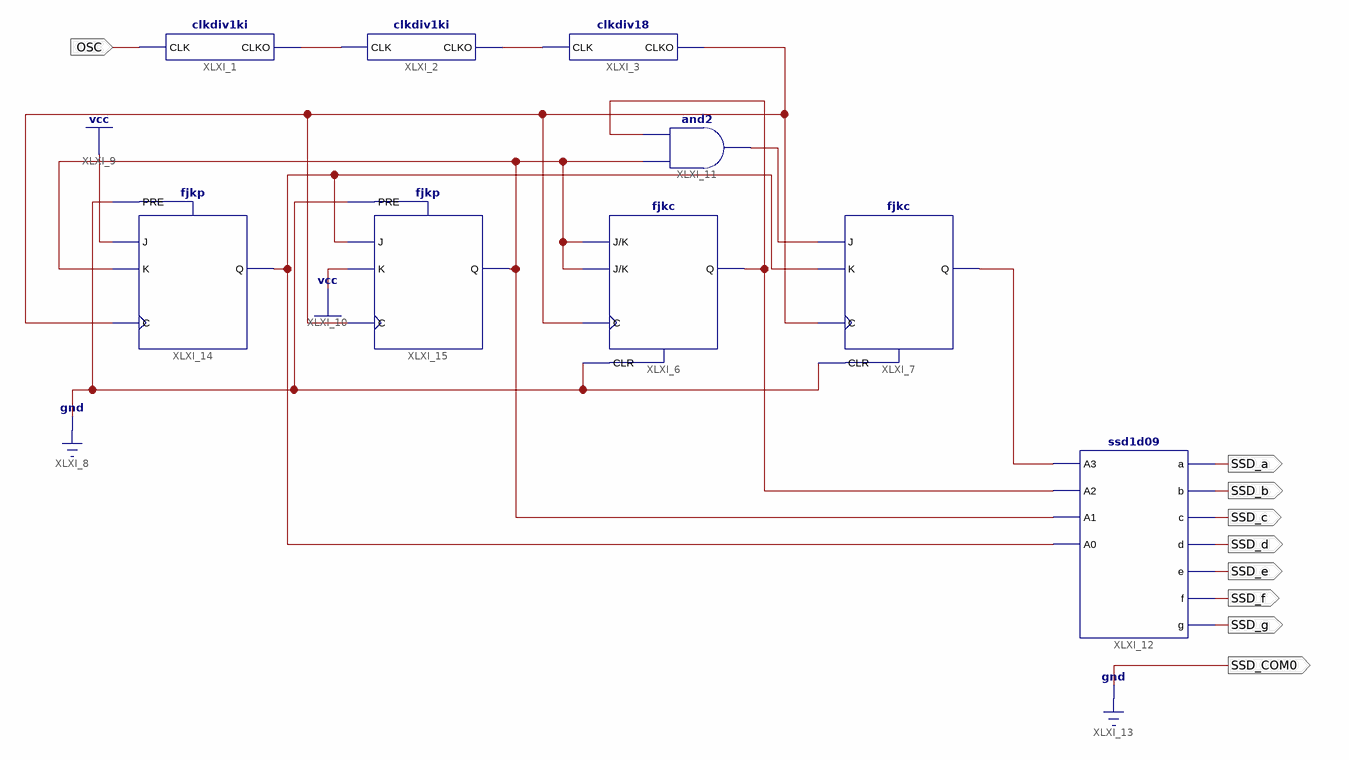
[diagram p0: schematic sheet 1]
// Xilinx ISE schematic integration.sch (spartan6) as structural Verilog: 9 symbols, 9 ports
module integration (
  input  OSC,
  output SSD_a,
  output SSD_b,
  output SSD_c,
  output SSD_d,
  output SSD_e,
  output SSD_f,
  output SSD_g,
  output SSD_COM0
);

  wire XLXN_2, XLXN_3, XLXN_8, XLXN_17, XLXN_18, XLXN_20, XLXN_21, XLXN_22;

  clkdiv1ki XLXI_1 (.CLK(OSC), .CLKO(XLXN_2));
  clkdiv1ki XLXI_2 (.CLK(XLXN_2), .CLKO(XLXN_3));
  clkdiv18 XLXI_3 (.CLK(XLXN_3), .CLKO(XLXN_8));
  fjkc XLXI_6 (.C(XLXN_8), .CLR(1'b0), .J(XLXN_18), .K(XLXN_18), .Q(XLXN_21));
  fjkc XLXI_7 (.C(XLXN_8), .CLR(1'b0), .J(XLXN_20), .K(XLXN_17), .Q(XLXN_22));
  and XLXI_11 (XLXN_20, XLXN_18, XLXN_21);
  ssd1d09 XLXI_12 (
    .a(SSD_a), .A0(XLXN_17), .A1(XLXN_18), .A2(XLXN_21), .A3(XLXN_22), .b(SSD_b), .c(SSD_c), .d(SSD_d),
    .e(SSD_e), .f(SSD_f), .g(SSD_g));
  fjkp XLXI_14 (.C(XLXN_8), .J(1'b1), .K(XLXN_18), .PRE(1'b0), .Q(XLXN_17));
  fjkp XLXI_15 (.C(XLXN_8), .J(XLXN_17), .K(1'b1), .PRE(1'b0), .Q(XLXN_18));

  assign SSD_COM0 = 1'b0;
endmodule
